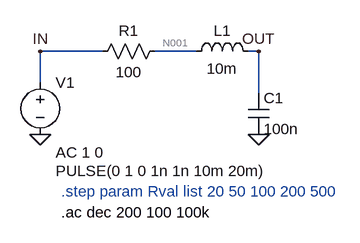
[diagram p0: schematic Draft1.asc]
Draft1.asc, the LTspice schematic file:
Version 4.1
SHEET 1 880 680
WIRE 192 32 96 32
WIRE 336 32 272 32
WIRE 432 32 416 32
WIRE 96 80 96 32
WIRE 432 96 432 32
FLAG 432 160 0
FLAG 96 160 0
FLAG 96 32 IN
FLAG 432 32 OUT
SYMBOL voltage 96 64 R0
WINDOW 3 24 152 Left 2
WINDOW 123 24 124 Left 2
WINDOW 39 0 0 Left 0
SYMATTR InstName V1
SYMATTR Value PULSE(0 1 0 1n 1n 10m 20m)
SYMATTR Value2 AC 1 0
SYMBOL res 288 16 R90
WINDOW 0 0 56 VBottom 2
WINDOW 3 32 56 VTop 2
SYMATTR InstName R1
SYMATTR Value 100
SYMBOL ind 320 48 R270
WINDOW 0 32 56 VTop 2
WINDOW 3 5 56 VBottom 2
SYMATTR InstName L1
SYMATTR Value 10m
SYMATTR SpiceLine Rser=1m
SYMBOL cap 416 96 R0
SYMATTR InstName C1
SYMATTR Value 100n
TEXT 128 248 Left 2 ;.step param Rval list 20 50 100 200 500
TEXT 128 280 Left 2 !.ac dec 200 100 100k

The netlist it stands for:
* Draft1.asc
V1 IN 0 PULSE(0 1 0 1n 1n 10m 20m) AC 1 0
R1 N001 IN 100
L1 N001 OUT 10m Rser=1m
C1 OUT 0 100n
* .step param Rval list 20 50 100 200 500
.ac dec 200 100 100k
.backanno
.end

* Results of the author's LTspice run, read from the files saved beside the schematic
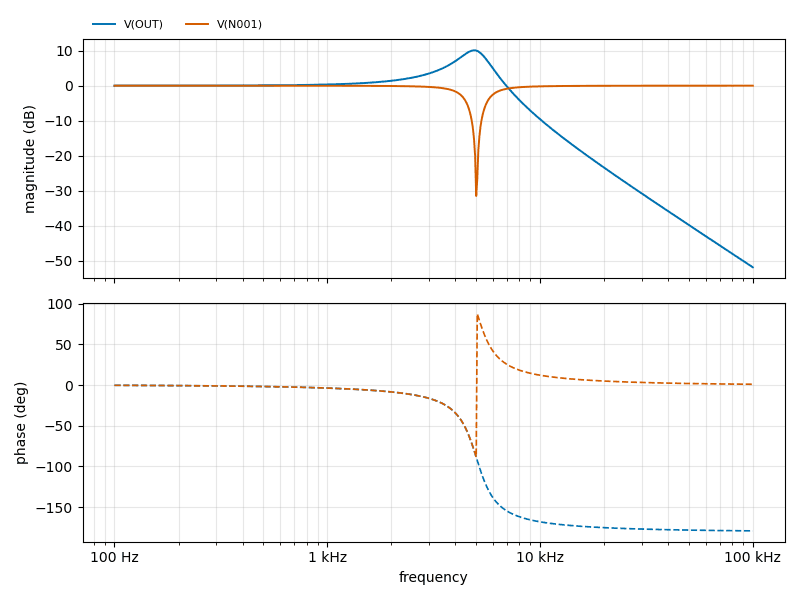
[diagram p1: AC Analysis of Draft1.asc, plotted from the saved traces]
* AC Analysis, 1 run:
*   V(OUT): 0.00 dB at 100 Hz, -51.91 dB at 100 kHz, peak 10.11 dB at 4.898 kHz, 3 dB below the peak at 4.019 kHz and 5.654 kHz
*   V(N001): -0.00 dB at 100 Hz, -0.00 dB at 100 kHz, peak -0.00 dB at 100 Hz, 3 dB below the peak at 4.299 kHz